# EAGLE design Hypnos_V0 (EAGLE 9.6.1)
APPROVED: -; CHECKED: MAR; DRAWN: MAR; REVISION: -

## Sheet 1 of 3
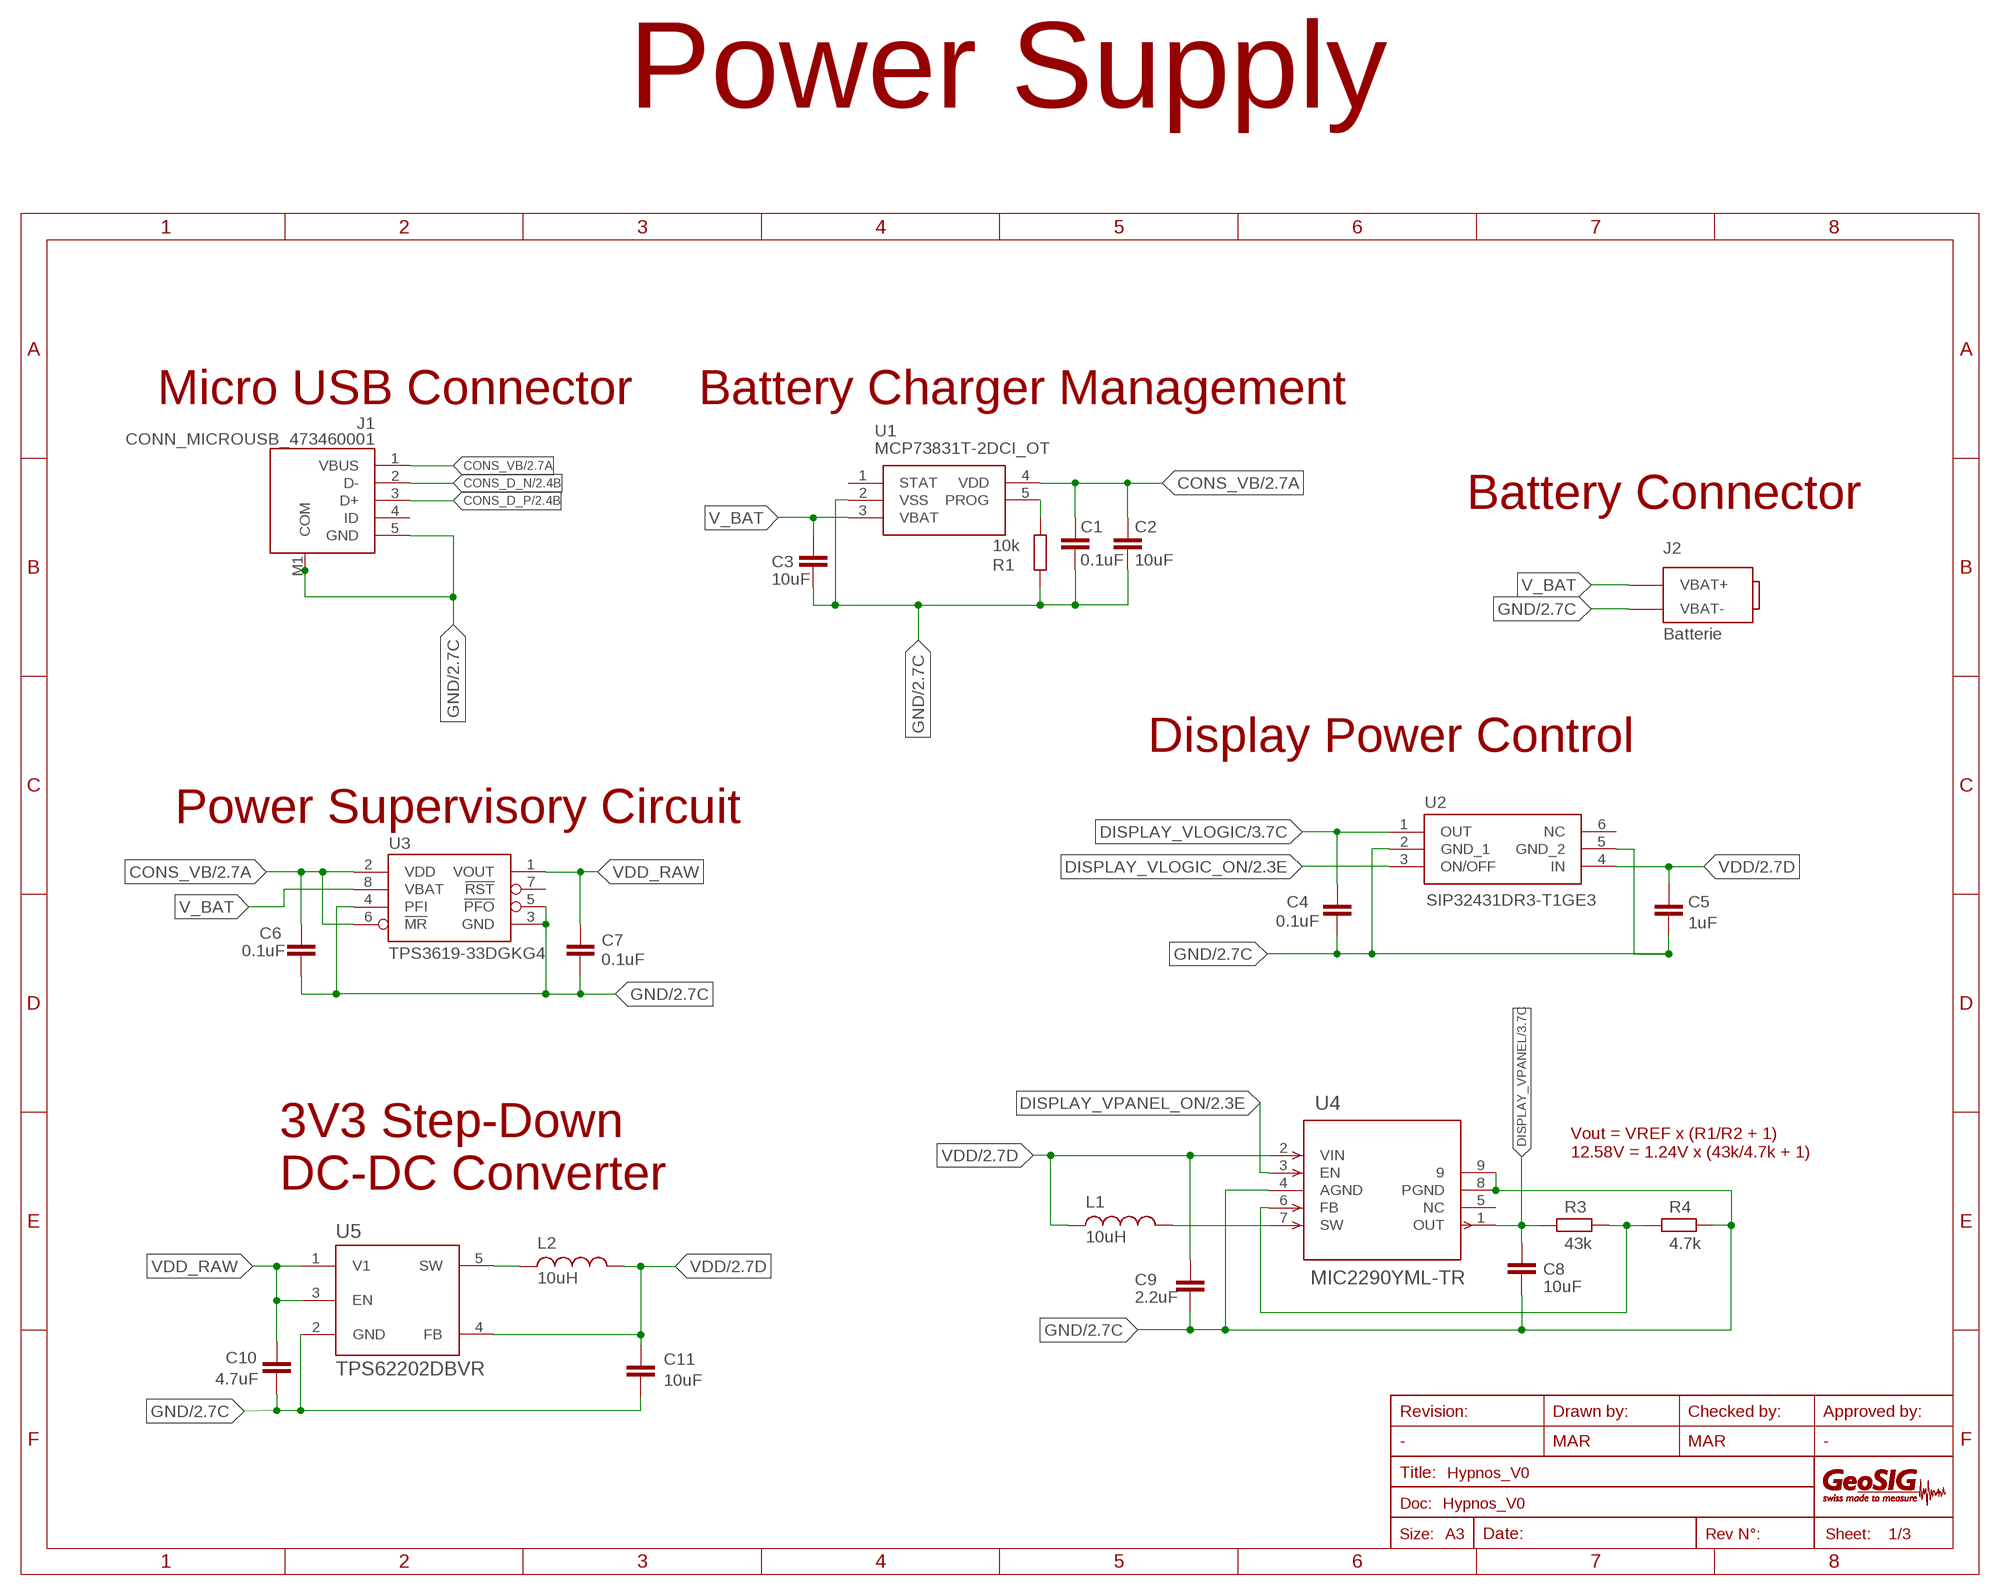
[diagram p0: schematic, sheet 1]
FRAME1 (FRAME_A4_REVIEWED): ASSEMBLY: A0; CHECKED: MAR; DRAWN: MAR; EAN: NONE; GSN: NONE; IN_BOM: NO; MPN: NONE; ORGANISATION: GeoSIG Ltd. Switzerland; TITLE: Hypnos_V0

### Parts
C1  0.1uF  C0603  [C0603K]
C2  10uF  C0603  [C0603K]
C3  10uF  C0603  [C0603K]
C4  0.1uF  C0603  [C0603K]
C5  1uF  C0603  [C0603K]
C6  0.1uF  C0603  [C0603K]
C7  0.1uF  C0603  [C0603K]
C8  10uF  C0603  [C0603K]
C9  2.2uF  C0603  [C0603K]
C10  4.7uF  C0603  [C0603K]
C11  10uF  C0603  [C0603K]
J1  CONN_MICROUSB_473460001  [CONN_MOLEX_473460001]
J2  Batterie  BATTERIE  [BATTERIE]
L1  10uH  INDUCT1210  [L1210]
L2  10uH  INDUCT1210  [L1210]
R1  10k  R-EU_R0603  [R0603]
R3  43k  R-EU_R0603  [R0603]
R4  4.7k  R-EU_R0603  [R0603]
U1  MCP73831T-2DCI_OT  [SOT95P270X145-5N]
U2  SIP32431DR3-T1GE3  [SOT65P210X110-6N]
U3  TPS3619-33DGKG4  [MSOP8]
U4  MIC2290YML-TR  [MLF-8_ML_MCH]
U5  TPS62202DBVR  [SOT95P280X145-5N]

### Nets
CONS_D_N: J1.2(D-) ; also sheet 2
CONS_D_P: J1.3(D+) ; also sheet 2
CONS_VB: C1.1 C2.1 C6.1 J1.1(VBUS) U1.4(VDD) U3.2(VDD) U3.6(!MR) ; also sheet 2
DISPLAY_VLOGIC: C4.1 U2.1(OUT) ; also sheet 3
DISPLAY_VLOGIC_ON: U2.3(ON/OFF) ; also sheet 2
DISPLAY_VPANEL: C8.1 R3.2 U4.1(OUT) ; also sheet 3
DISPLAY_VPANEL_ON: U4.3(EN) ; also sheet 2
FB: R3.1 R4.2 U4.6(FB)
GND: C1.2 C2.2 C3.2 C4.2 C5.2 C6.2 C7.2 C8.2 C9.2 C10.2 C11.2 J1.5(GND) J1.M1(COM) J1.M2(COM) J1.M3(COM) J1.M4(COM) J1.M5(COM) J1.M6(COM) J2.2(VBAT-) R1.2 R4.1 U1.2(VSS) U2.2(GND_1) U2.5(GND_2) U3.3(GND) U3.4(PFI) U3.5(!PFO) U4.4(AGND) U4.8(PGND) U4.9 U5.2(GND) ; also sheet 2,3
N$4: L2.1 U5.5(SW)
PROG: R1.1 U1.5(PROG)
SW: L1.2 U4.7(SW)
V_BAT: C3.1 J2.1(VBAT+) U1.3(VBAT) U3.8(VBAT)
VDD: C5.1 C9.1 C11.1 L1.1 L2.2 U2.4(IN) U4.2(VIN) U5.4(FB) ; also sheet 2,3
VDD_RAW: C7.1 C10.1 U3.1(VOUT) U5.1(V1) U5.3(EN)
Unconnected: J1.4(ID) U1.1(STAT) U2.6(NC) U3.7(!RST) U4.5(NC)

### Notes on the sheet
- Power Supply
- Micro USB Connector | Battery Charger Management
- Battery Connector
- Display Power Control
- Power Supervisory Circuit
- Vout = VREF x (R1/R2 + 1)
  12.58V = 1.24V x (43k/4.7k + 1)
- 3V3 Step-Down
  DC-DC Converter

## Sheet 2 of 3
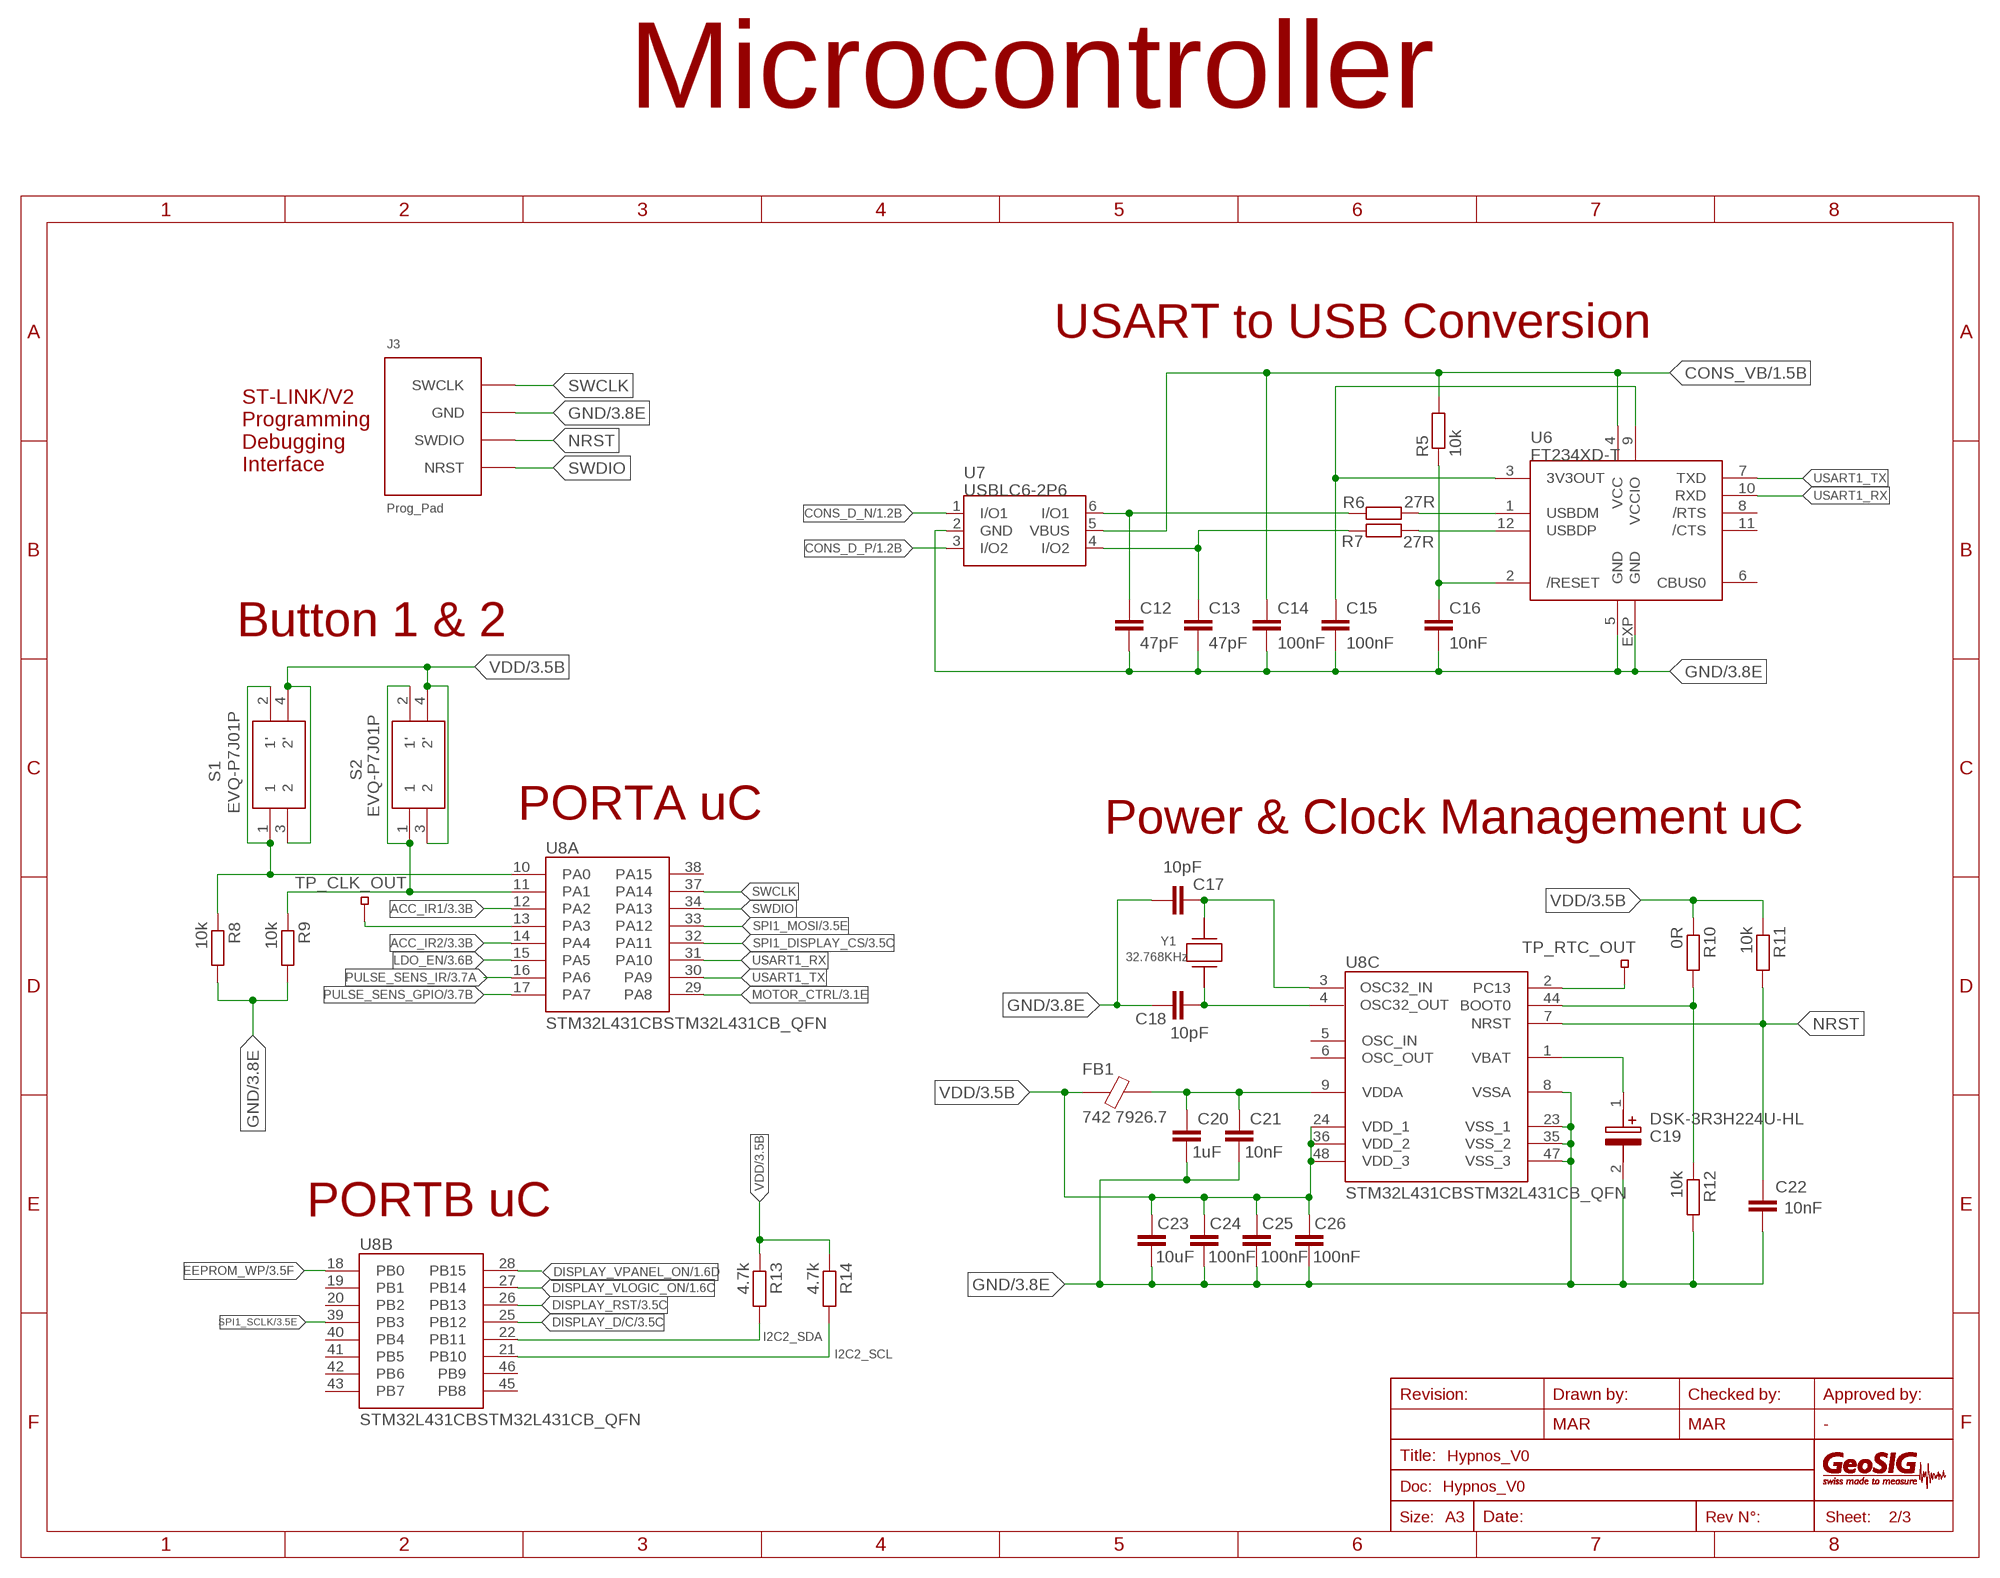
[diagram p1: schematic, sheet 2]
FRAME2 (FRAME_A4_REVIEWED): ASSEMBLY: A0; EAN: NONE; GSN: NONE; IN_BOM: NO; MPN: NONE; ORGANISATION: GeoSIG Ltd. Switzerland; TITLE: Hypnos_V0

### Parts
C12  47pF  C0603  [C0603K]
C13  47pF  C0603  [C0603K]
C14  100nF  C0603  [C0603K]
C15  100nF  C0603  [C0603K]
C16  10nF  C0603  [C0603K]
C17  10pF  C0603  [C0603K]
C18  10pF  C0603  [C0603K]
C19  DSK-3R3H224U-HL  [DSK3R3H334THL]
C20  1uF  C0603  [C0603K]
C21  10nF  C0603  [C0603K]
C22  10nF  C0603  [C0603K]
C23  10uF  C0603  [C0603K]
C24  100nF  C0603  [C0603K]
C25  100nF  C0603  [C0603K]
C26  100nF  C0603  [C0603K]
FB1  742 7926.7  FERRITE_BEAD0603  [FB0603]
J3  Prog_Pad  PROG_PAD  [PROG_PAD]
R5  10k  R-EU_R0603  [R0603]
R6  27R  R-EU_R0603  [R0603]
R7  27R  R-EU_R0603  [R0603]
R8  10k  R-EU_R0603  [R0603]
R9  10k  R-EU_R0603  [R0603]
R10  0R  R-EU_R0603  [R0603]
R11  10k  R-EU_R0603  [R0603]
R12  10k  R-EU_R0603  [R0603]
R13  4.7k  R-EU_R0603  [R0603]
R14  4.7k  R-EU_R0603  [R0603]
S1  EVQ-P7J01P  [EVQP7J01P]
S2  EVQ-P7J01P  [EVQP7J01P]
TP_CLK_OUT  TEST_PIN_SMD  [SMD_1]
TP_RTC_OUT  TEST_PIN_SMD  [SMD_1]
U6  FT234XD-T  [DFN12-3X3]
U7  USBLC6-2P6  [SOT666]
U8  STM32L431CBSTM32L431CB_QFN  [QFN50P700X700X60-49N]
Y1  32.768KHz  QUARTZ1-CM315-32.768KDZY-UT  [CM315]

### Nets
/RESET: C16.1 R5.1 U6.2(/RESET)
ACC_IR1: U8.12(A:PA2) ; also sheet 3
ACC_IR2: U8.14(A:PA4) ; also sheet 3
BUTTON1: R8.1 S1.1 S1.2(1') U8.10(A:PA0)
BUTTON2: R9.1 S2.1 S2.2(1') U8.11(A:PA1)
CLK_OUT: TP_CLK_OUT.P$1 U8.13(A:PA3)
CONS_D_N: U7.1(I/O1) ; also sheet 1
CONS_D_P: U7.3(I/O2) ; also sheet 1
CONS_VB: C14.1 R5.2 U6.4(VCC) U7.5(VBUS) ; also sheet 1
DISPLAY_D/C: U8.25(B:PB12) ; also sheet 3
DISPLAY_RST: U8.26(B:PB13) ; also sheet 3
DISPLAY_VLOGIC_ON: U8.27(B:PB14) ; also sheet 1
DISPLAY_VPANEL_ON: U8.28(B:PB15) ; also sheet 1
EEPROM_WP: U8.18(B:PB0) ; also sheet 3
GND: C12.2 C13.2 C14.2 C15.2 C16.2 C17.2 C18.2 C19.2(-) C20.2 C21.2 C22.2 C23.2 C24.2 C25.2 C26.2 J3.2(GND) R8.2 R9.2 R12.2 U6.5(GND) U6.EXP(GND) U7.2(GND) U8.8(C:VSSA) U8.23(C:VSS_1) U8.35(C:VSS_2) U8.47(C:VSS_3) ; also sheet 1,3
I2C2_SCL: R14.2 U8.21(B:PB10) ; also sheet 3
I2C2_SDA: R13.2 U8.22(B:PB11) ; also sheet 3
LDO_EN: U8.15(A:PA5) ; also sheet 3
MOTOR_CTRL: U8.29(A:PA8) ; also sheet 3
N$1: C18.1 U8.4(C:OSC32_OUT) Y1.P$2
N$2: C17.1 U8.3(C:OSC32_IN) Y1.P$1
N$3: C19.1(+) U8.1(C:VBAT)
N$9: R10.2 R12.1 U8.44(C:BOOT0)
N$41: C13.1 R7.2 U7.4(I/O2)
N$42: C12.1 R6.2 U7.6(I/O1)
NRST: C22.1 J3.3(SWDIO) R11.2 U8.7(C:NRST)
PULSE_SENS_GPIO: U8.17(A:PA7) ; also sheet 3
PULSE_SENS_IR: U8.16(A:PA6) ; also sheet 3
RTC_OUT: TP_RTC_OUT.P$1 U8.2(C:PC13)
SPI1_DISPLAY_CS: U8.32(A:PA11) ; also sheet 3
SPI1_MOSI: U8.33(A:PA12) ; also sheet 3
SPI1_SCLK: U8.39(B:PB3) ; also sheet 3
SWCLK: J3.1(SWCLK) U8.37(A:PA14)
SWDIO: J3.4(NRST) U8.34(A:PA13)
USART1_RX: U6.10(RXD) U8.31(A:PA10)
USART1_TX: U6.7(TXD) U8.30(A:PA9)
USBDM: R6.1 U6.1(USBDM)
USBDP: R7.1 U6.12(USBDP)
VCCIO: C15.1 U6.3(3V3OUT) U6.9(VCCIO)
VDD: C23.1 C24.1 C25.1 C26.1 FB1.1 R10.1 R11.1 R13.1 R14.1 S1.3 S1.4(2') S2.3 S2.4(2') U8.24(C:VDD_1) U8.36(C:VDD_2) U8.48(C:VDD_3) ; also sheet 1,3
VDDA: C20.1 C21.1 FB1.2 U8.9(C:VDDA)
Unconnected: U6.6(CBUS0) U6.8(/RTS) U6.11(/CTS) U8.5(C:OSC_IN) U8.6(C:OSC_OUT) U8.19(B:PB1) U8.20(B:PB2) U8.38(A:PA15) U8.40(B:PB4) U8.41(B:PB5) U8.42(B:PB6) U8.43(B:PB7) U8.45(B:PB8) U8.46(B:PB9)

### Notes on the sheet
- Microcontroller
- USART to USB Conversion
- ST-LINK/V2 
  Programming 
  Debugging 
  Interface
- Button 1 & 2
- PORTA uC | Power & Clock Management uC
- PORTB uC

## Sheet 3 of 3
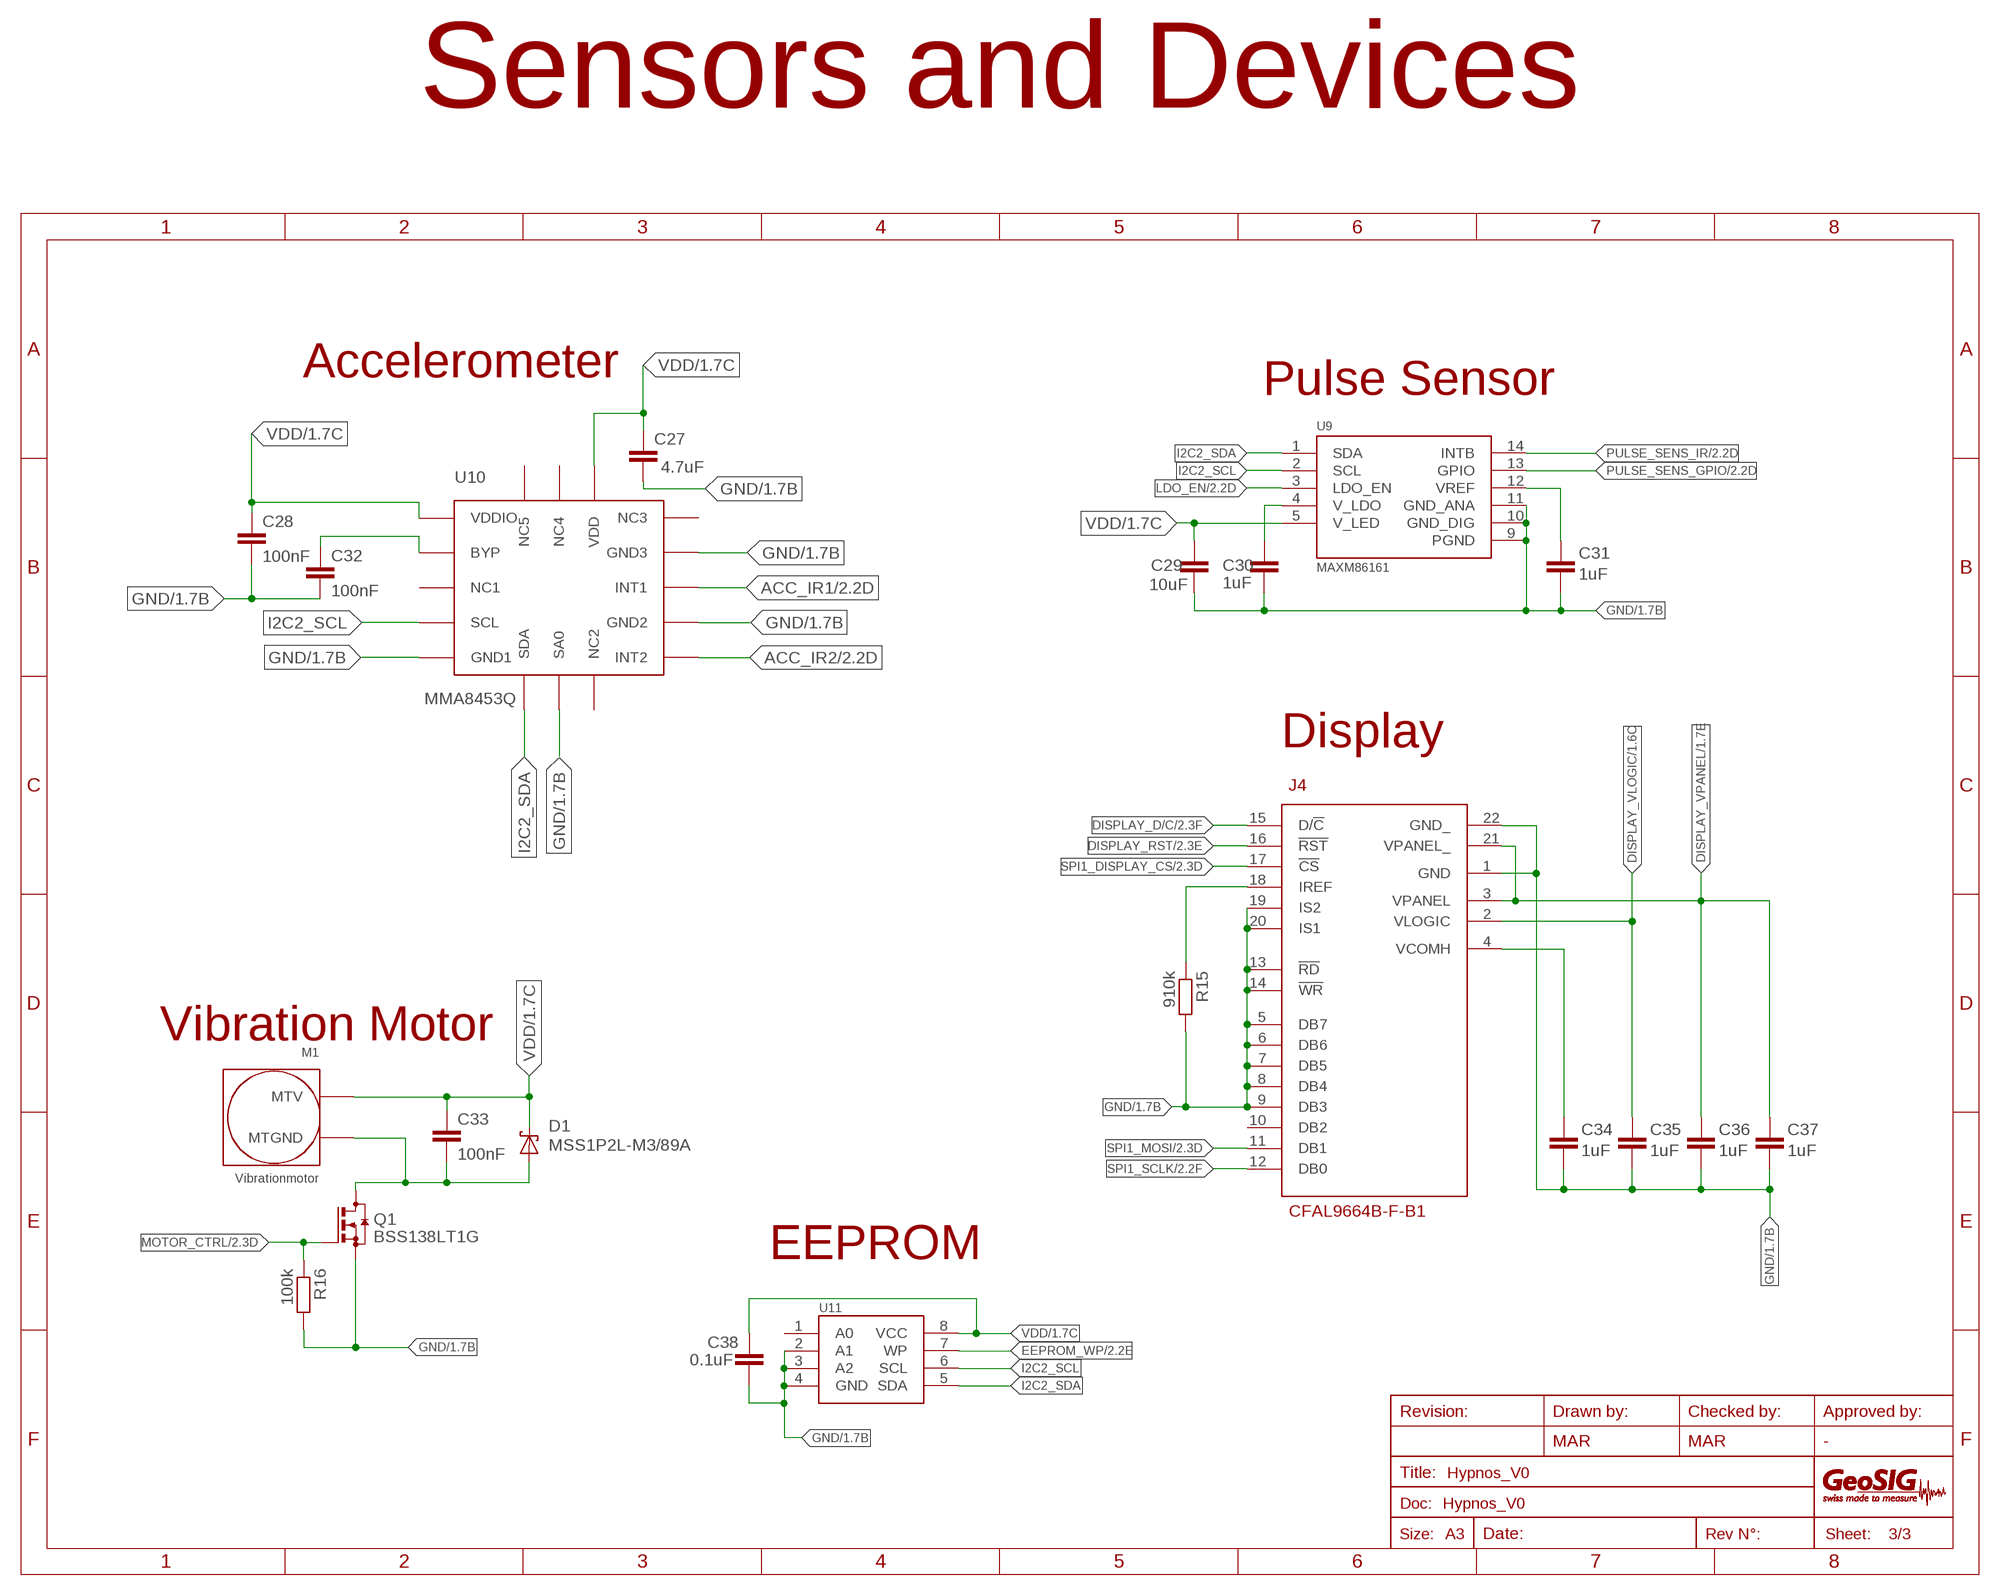
[diagram p2: schematic, sheet 3]
FRAME3 (FRAME_A4_REVIEWED): ASSEMBLY: A0; EAN: NONE; GSN: NONE; IN_BOM: NO; MPN: NONE; ORGANISATION: GeoSIG Ltd. Switzerland; TITLE: Hypnos_V0

### Parts
C27  4.7uF  C0603  [C0603K]
C28  100nF  C0603  [C0603K]
C29  10uF  C0603  [C0603K]
C30  1uF  C0603  [C0603K]
C31  1uF  C0603  [C0603K]
C32  100nF  C0603  [C0603K]
C33  100nF  C0603  [C0603K]
C34  1uF  C0603  [C0603K]
C35  1uF  C0603  [C0603K]
C36  1uF  C0603  [C0603K]
C37  1uF  C0603  [C0603K]
C38  0.1uF  C0603  [C0603K]
D1  MSS1P2L-M3/89A  [MICROSMP]
J4  CFAL9664B-F-B1  [CFAL9664B-F-B1]
M1  Vibrationmotor  VIBRATIONMOTOR  [VIBRATIONMOTOR]
Q1  BSS138LT1G  [SOT23]
R15  910k  R-EU_R0603  [R0603]
R16  100k  R-EU_R0603  [R0603]
U9  MAXM86161  [MAXM86161]
U10  MMA8453Q  [QFN-COL]
U11  BR24T1MFJ-3AME2  [SOIC127P600X165-8N]

### Nets
ACC_IR1: U10.P$11(INT1) ; also sheet 2
ACC_IR2: U10.P$9(INT2) ; also sheet 2
BYP: C32.1 U10.P$2(BYP)
DISPLAY_D/C: J4.15(D/!C) ; also sheet 2
DISPLAY_RST: J4.16(!RST) ; also sheet 2
DISPLAY_VLOGIC: C35.1 J4.2(VLOGIC) ; also sheet 1
DISPLAY_VPANEL: C36.1 C37.1 J4.3(VPANEL) J4.21(VPANEL_) ; also sheet 1
EEPROM_WP: U11.7(WP) ; also sheet 2
GND: C27.2 C28.2 C29.2 C30.2 C31.2 C32.2 C34.2 C35.2 C36.2 C37.2 C38.2 J4.1(GND) J4.5(DB7) J4.6(DB6) J4.7(DB5) J4.8(DB4) J4.9(DB3) J4.13(!RD!) J4.14(!WR!) J4.19(IS2) J4.20(IS1) J4.22(GND_) Q1.2(S) R15.2 R16.2 U9.9(PGND) U9.10(GND_DIG) U9.11(GND_ANA) U10.P$5(GND1) U10.P$7(SA0) U10.P$10(GND2) U10.P$12(GND3) U11.2(A1) U11.3(A2) U11.4(GND) ; also sheet 1,2
I2C2_SCL: U9.2(SCL) U10.P$4(SCL) U11.6(SCL) ; also sheet 2
I2C2_SDA: U9.1(SDA) U10.P$6(SDA) U11.5(SDA) ; also sheet 2
IREF: J4.18(IREF) R15.1
LDO_EN: U9.3(LDO_EN) ; also sheet 2
MOTOR_CTRL: Q1.1(G) R16.1 ; also sheet 2
MTGND: C33.2 D1.A M1.1(MTGND) Q1.3(D)
PULSE_SENS_GPIO: U9.13(GPIO) ; also sheet 2
PULSE_SENS_IR: U9.14(INTB) ; also sheet 2
SPI1_DISPLAY_CS: J4.17(!CS) ; also sheet 2
SPI1_MOSI: J4.11(DB1) ; also sheet 2
SPI1_SCLK: J4.12(DB0) ; also sheet 2
V_LDO: C30.1 U9.4(V_LDO)
V_REF: C31.1 U9.12(VREF)
VCOMH: C34.1 J4.4(VCOMH)
VDD: C27.1 C28.1 C29.1 C33.1 C38.1 D1.C M1.2(MTV) U9.5(V_LED) U10.P$1(VDDIO) U10.P$14(VDD) U11.8(VCC) ; also sheet 1,2
Unconnected: J4.10(DB2) U10.P$3(NC1) U10.P$8(NC2) U10.P$13(NC3) U10.P$15(NC4) U10.P$16(NC5) U11.1(A0)

### Notes on the sheet
- Sensors and Devices
- Accelerometer
- Pulse Sensor
- Display
- Vibration Motor
- EEPROM

## Library data of the parts
C1-C18 C20-C38 = GS_Capacitor:C: CAPACITOR naming: grid - package width; ASSEMBLY: A0; EAN: NONE; GSN: NONE; IN_BOM: YES; MPN: NONE
C19 = SamacSys_Parts:DSK-3R3H224U-HL: Supercapacitors / Ultracapacitors 3.3V .22F 6.8x2.1 Source: Datasheet <https://componentsearchengine.com/Datasheets/1/DSK-3R3H224U-HL.pdf>; DESCRIPTION: Supercapacitors / Ultracapacitors 3.3V .22F 6.8x2.1; HEIGHT: 3mm; MANUFACTURER_NAME: Elna; MANUFACTURER_PART_NUMBER: DSK-3R3H224U-HL; MOUSER_PART_NUMBER: 555-DSK3R3H224U-HL; MOUSER_PRICE-STOCK: https://www.mouser.co.uk/ProductDetail/Elna/DSK-3R3H224U-HL?qs=QQsyD2Kvh2ftLwsh6FwcaA%3D%3D
D1 = GS_Diode:MSS1P2L: Diode Schottky, 20V, 1A, Diodes & Rectifiers, MSS1P2L-M3/89A, Vishay; A: A; ASSEMBLY: A0; C: C; EAN: 2900000154810; GSN: #D_SKY.200.001; IN_BOM: YES; MPN: MSS1P2L-M3/89A
FB1 = GS_Other:FERRITE_BEAD; ASSEMBLY: A0; EAN: NONE; GSN: NONE; IN_BOM: YES; MPN: NONE
J1 = GS_Connector:CONN_MICROUSB_473460001: Molex MicroUSB type B socket.; ASSEMBLY: A0; EAN: NONE; GSN: NONE; IN_BOM: YES; MPN: 47346-0001
J2 = Batterie:BATTERIE
J3 = Prog_Pad:PROG_PAD
J4 = CFAL9664B-F-B1:CFAL9664B-F-B1
L1 L2 = GS_Inductor:INDUCT; ASSEMBLY: A0; EAN: NONE; GSN: NONE; IN_BOM: YES; MPN: NONE
M1 = Vibrationmotor:VIBRATIONMOTOR
Q1 = GS_Transistor:BSS138: Transistor Small signal FET, 220mA, 50V, 3 PINS, SOT-23, BSS138, MOSFET, N-Channel, SOT-23, 50V, 200mA, 3.5R; ASSEMBLY: A0; EAN: 2900000154612; GSN: #T_SSF.000.006; IN_BOM: YES; MPN: BSS138LT1G
R1 R3-R16 = GS_Resistor:R-EU_: RESISTOR, European symbol; ASSEMBLY: A0; EAN: NONE; GSN: NONE; IN_BOM: YES; MPN: NONE
S1 S2 = SamacSys_Parts:EVQ-P7J01P: Switch,Tactile,3.5x2.9mm,Light Touch Black Side Tactile Switch, SPST 50 mA@ 12 V dc 1.7mm Source: Datasheet <https://www3.panasonic.biz/ac/e_download/control/switch/light-touch/catalog/sw_lt_eng_3529s_side.pdf>; DESCRIPTION: Switch,Tactile,3.5x2.9mm,Light Touch Black Side Tactile Switch, SPST 50 mA@ 12 V dc 1.7mm; HEIGHT: 1mm; MANUFACTURER_NAME: Panasonic; MANUFACTURER_PART_NUMBER: EVQ-P7J01P; MOUSER_PART_NUMBER: 667-EVQP7J01P; MOUSER_PRICE-STOCK: https://www.mouser.co.uk/ProductDetail/Panasonic/EVQ-P7J01P?qs=rJ%252BziJWpyszkfuBTA00z9w%3D%3D
TP_CLK_OUT TP_RTC_OUT = GS_Jumper:TEST_PIN_SMD; ASSEMBLY: A0; EAN: NONE; GSN: NONE; IN_BOM: NO; MPN: NONE
U1 = SamacSys_Parts:MCP73831T-2DCI_OT: Charge Controller Li-Ion/Li-Pol Source: Datasheet <http://ww1.microchip.com/downloads/en/DeviceDoc/20001984g.pdf>; DESCRIPTION: Charge Controller Li-Ion/Li-Pol; HEIGHT: 1.45mm; MANUFACTURER_NAME: Microchip; MANUFACTURER_PART_NUMBER: MCP73831T-2DCI/OT; MOUSER_PART_NUMBER: 579-MCP73831T-2DCIOT; MOUSER_PRICE-STOCK: https://www.mouser.co.uk/ProductDetail/Microchip-Technology/MCP73831T-2DCI-OT?qs=yUQqVecv4qu38ml9qkvsJw%3D%3D
U2 = SamacSys_Parts:SIP32431DR3-T1GE3: VISHAY - SIP32431DR3-T1GE3 - IC, LOAD SWITCH, 1.1V-5.5V, 1A, SC70 Source: Datasheet <https://www.vishay.com/docs/66597/sip32431.pdf>; DESCRIPTION: VISHAY - SIP32431DR3-T1GE3 - IC, LOAD SWITCH, 1.1V-5.5V, 1A, SC70; HEIGHT: 1.1mm; MANUFACTURER_NAME: Vishay; MANUFACTURER_PART_NUMBER: SIP32431DR3-T1GE3; MOUSER_PART_NUMBER: 781-SIP32431DR3-GE3; MOUSER_PRICE-STOCK: https://www.mouser.co.uk/ProductDetail/Vishay-Semiconductors/SIP32431DR3-T1GE3?qs=FfLXECYddQQfTuH6ZEcWCg%3D%3D
U3 = GS_IC:TPS3619-33: IC Power, MSOP8, TEXAS INSTRUMENTS, TPS3619-33DGKG4, SM SUPERVISORY CIRCUIT; ASSEMBLY: A0; EAN: 2900000080300; GSN: #U_PWR.000.009; IN_BOM: YES; MPN: TPS3619-33DGKG4
U4 = MIC2290YML-TR:MIC2290YML-TR; BUILT_BY: EMA_Jessica; COPYRIGHT: Copyright (C) 2018 Accelerated Designs. All rights reserved; MANUFACTURER_PART_NUMBER: MIC2290YML-TR; SOURCELIBRARY: Microchip_2019-08-23_2; VENDOR: Microchip
U5 = TPS62202DBVR:TPS62202DBVR: HIGH-EFFICIENCY, SOT23 STEP-DOWN, DC-DC CONVERTER; AVAILABILITY: Unavailable; DESCRIPTION: 1.8-V Output, 300-mA, 95% Efficient Step-Down Converter in SOT-23 5-SOT-23 -40 to 85; MF: Texas Instruments; MP: TPS62202DBVR; PACKAGE: SOT-23-5 Texas Instruments; PRICE: None
U6 = GS_IC:FT234XD: IC Line driver, SMD, DFN-12, USB to Basic Serial UART IC, FT234XD-T, FTDI; ASSEMBLY: A0; EAN: 2900000168039; GSN: #U_LDR.000.056.S; IN_BOM: YES; MPN: FT234XD-T
U7 = GS_Diode:USBLC6-2: Capacitor, 2.5pf, 5A, 6V, SMD, SOT666, Unidirectional, ESD Suppressors High Speed Interface Protection Low Cap, USBLC6-2P6, STMicroelectronics; ASSEMBLY: A0; EAN: 2900000168008; GSN: #C_112.002.006.S; IN_BOM: YES; MPN: USBLC6-2P6
U8 = STM32L431CB:STM32L431CB
U9 = MAXM86161:MAXM86161: Oximeter/Heart Rate Sensor; AVAILABILITY: Warning; DESCRIPTION: Oximeter/Heart Rate Sensor I²C Output; DIGIKEY-PURCHASE-URL: https://snapeda.com/shop?store=DigiKey&id=554104; MF: Maxim Integrated; MOUSER-PURCHASE-URL: https://snapeda.com/shop?store=Mouser&id=554104; MP: MAX30101EFD+; PACKAGE: OLGA-14 Maxim; PRICE: None
U10 = MMA8453Q:MMA8453Q; AVAILABILITY: Unavailable; DESCRIPTION: Accelerometer X, Y, Z Axis ±2g, 4g, 8g 0.78Hz ~ 400Hz 16-QFN _3x3_; MF: NXP Semiconductors; MP: MMA8453Q; PACKAGE: QFN-16 NXP Semiconductors; PRICE: None
U11 = BR24T1MFJ-3AME2:BR24T1MFJ-3AME2
Y1 = GS_Other:QUARTZ1: Quartz, SMD, 4 PINS, X; ASSEMBLY: A0; EAN: 2900000083868; GSN: #X_032.768.003.XX; IN_BOM: YES; MPN: CM315-32.768KDZY-UT

## Board
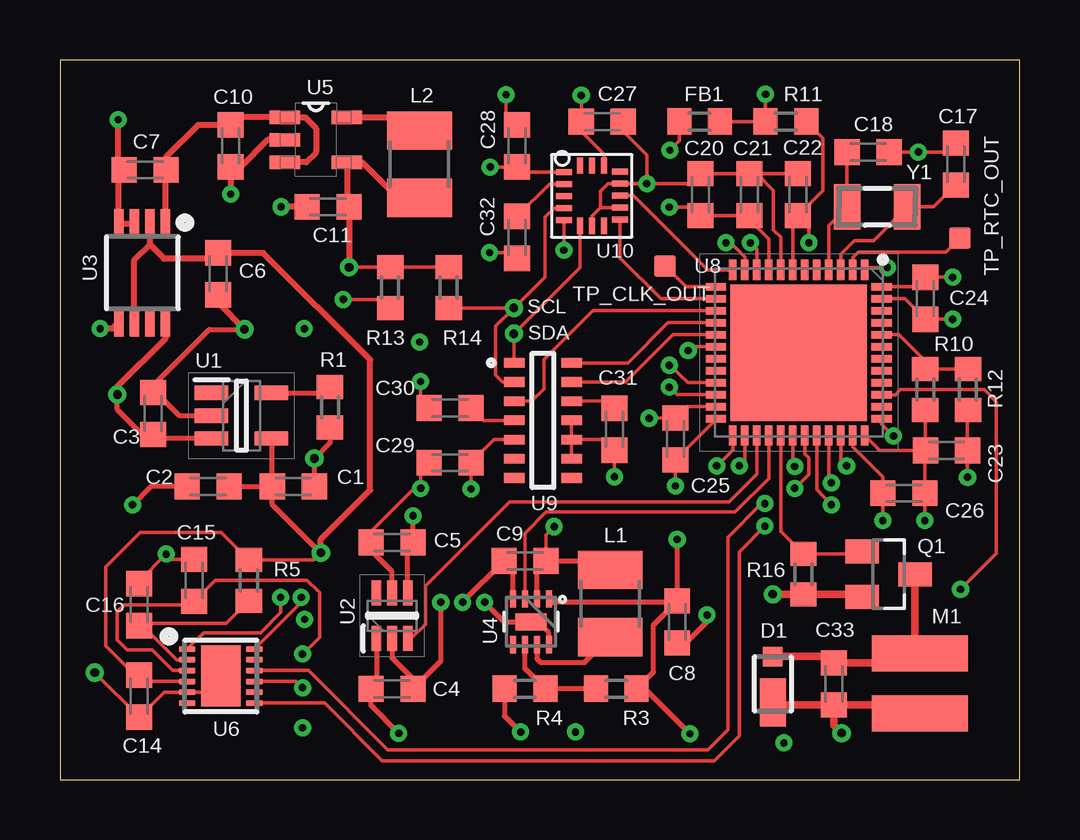
[diagram p3: board, top side]
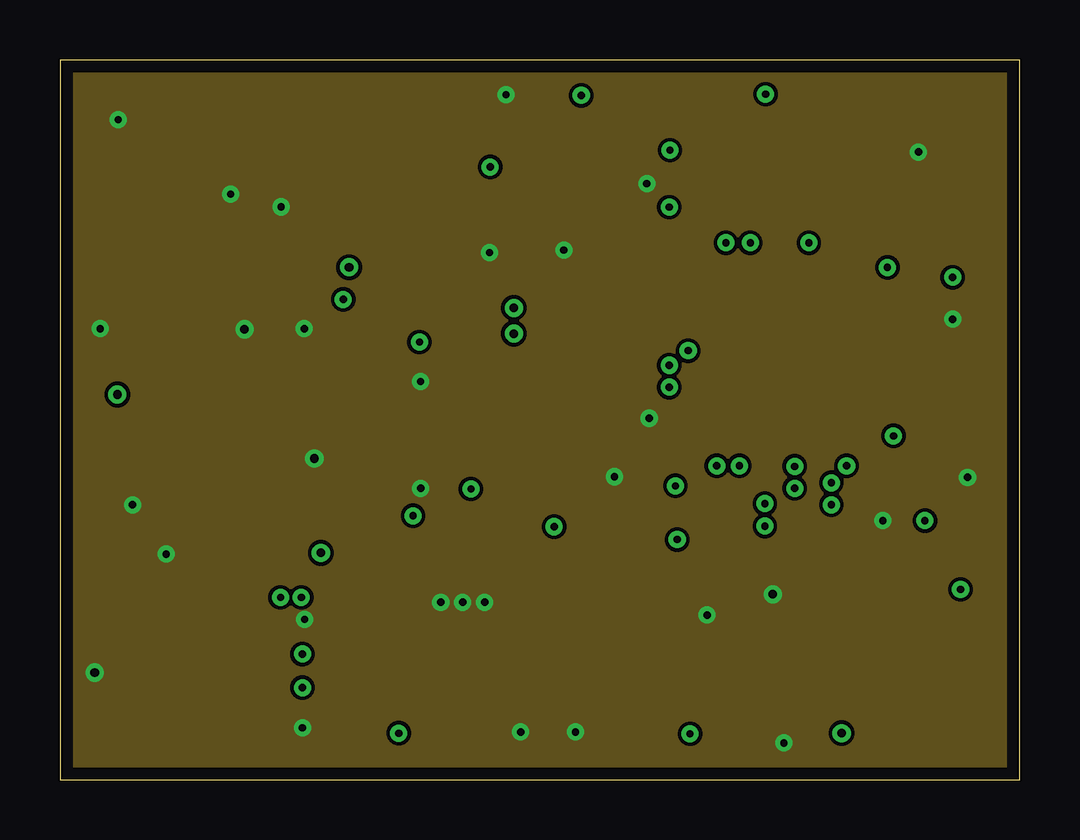
[diagram p4: board, inner layer Route2]
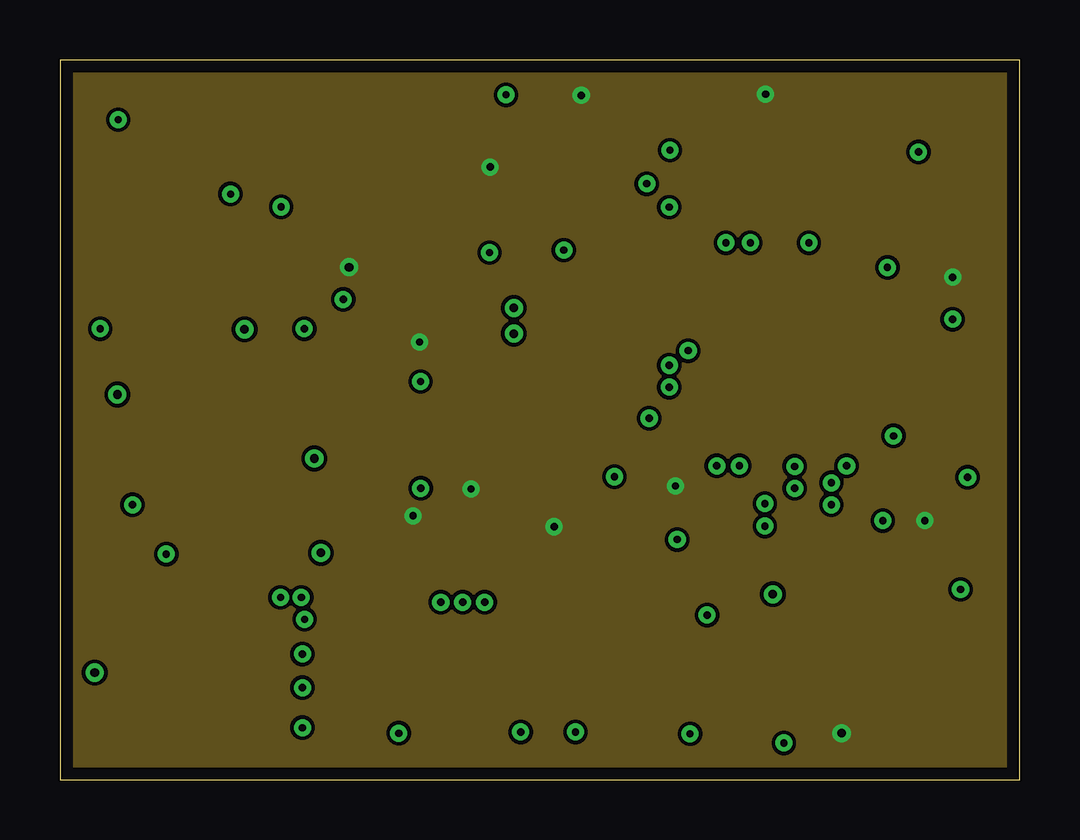
[diagram p5: board, inner layer Route15]
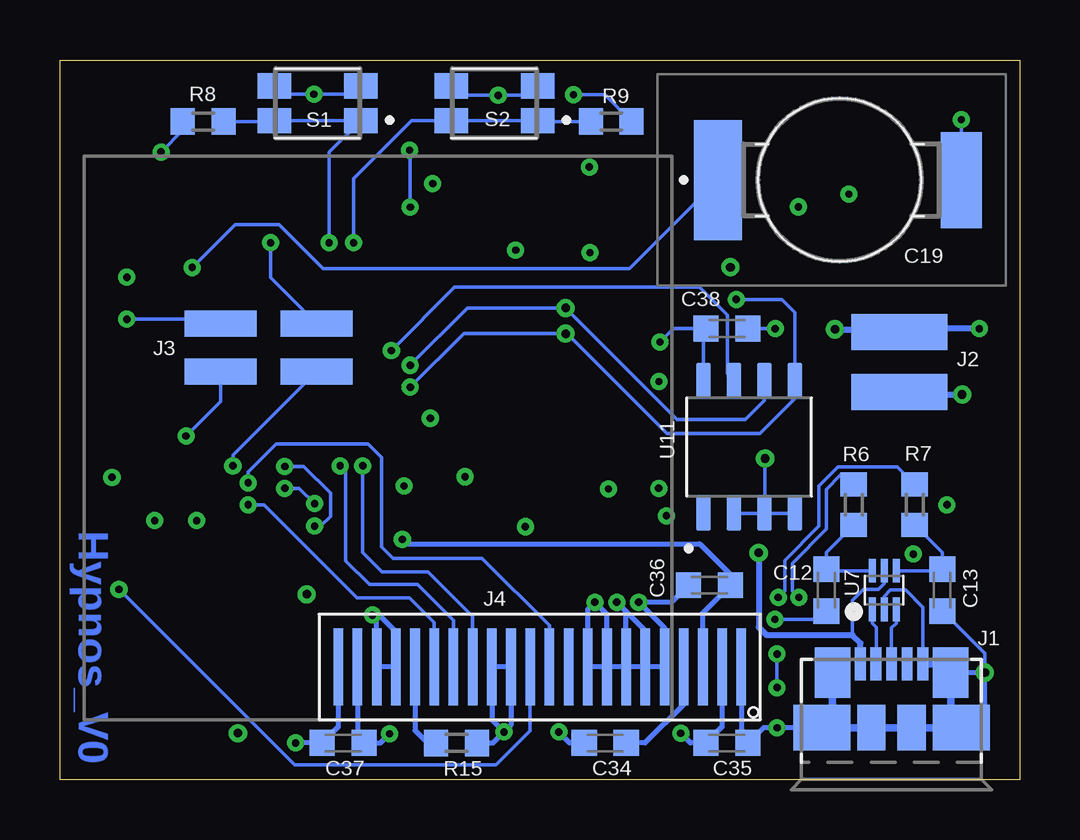
[diagram p6: board, bottom side, seen from below]

Size 40 x 30 mm. Coordinates in mm from the lower left corner, seen from the top.
Outline: 0,0 40,0 40,30 0,30 0,0
Copper layers (1*2*15*16): Top 0.035mm / dielectric 0.25mm / Route2 0.035mm / dielectric 0.96mm / Route15 0.035mm / dielectric 0.25mm / Bottom 0.035mm
Design rules "GS_4_layers": minimum track width 6mil, minimum drill 8mil, track to track 6mil, track to pad 6mil, pad to pad 6mil, via to via 6mil, smd to smd 6mil, copper to edge 20mil, drill to drill 8mil, minimum pad ring 10mil, minimum via ring 8mil, stop-mask expansion 2mil, vias tented up to drill 25mil, thermal gap 10mil

### Footprints (pad centres in the part's own frame; a part is rotated, then mirrored left to right if it is on the bottom)
C0603K = smd 1.05 x 1.08: 1 -0.875,0; 2 0.875,0
DSK3R3H334THL = smd 5 x 2: 1 0,5.075 | smd 4 x 1.7: 2 0,-5.075
MICROSMP = smd 0.813 x 0.813: A 1.143,0 | smd 2.007 x 1.092: C -0.762,0
FB0603 = smd 1 x 1.1: 1 -0.85,0; 2 0.85,0
CONN_MOLEX_473460001 = smd 0.45 x 1.38: 1 -1.3,2.66; 2 -0.65,2.66; 3 0,2.66; 4 0.65,2.66; 5 1.3,2.66 | smd 1.475 x 2.1: M1 2.462,2.3; M2 -2.462,2.3 | smd 1.175 x 1.9: M3 -0.838,0; M4 0.838,0 | smd 2.375 x 1.9: M5 -2.913,0; M6 2.913,0
BATTERIE = smd 4 x 1.5: 1 -0.04,-1.27; 2 -0.04,1.23
PROG_PAD = smd 3 x 1.1: 1 2,2; 2 2,4; 3 6,4; 4 6,2
CFAL9664B-F-B1 = smd 3.2 x 0.4: 1 0,-8.4; 2 0,-7.6; 3 0,-6.8; 4 0,-6; 5 0,-5.2; 6 0,-4.4; 7 0,-3.6; 8 0,-2.8; 9 0,-2; 10 0,-1.2; 11 0,-0.4; 12 0,0.4; 13 0,1.2; 14 0,2; 15 0,2.8; 16 0,3.6; 17 0,4.4; 18 0,5.2; 19 0,6; 20 0,6.8; 21 0,7.6; 22 0,8.4
L1210 = smd 1.6 x 2.7: 1 -1.4,0; 2 1.4,0
VIBRATIONMOTOR = smd 4 x 1.5: 1 -0.04,-1.27; 2 -0.04,1.23
SOT23 = smd 1 x 1.4: 1 -0.95,-1.1; 2 0.95,-1.1; 3 0,1.1
R0603 = smd 1 x 1.1: 1 -0.85,0; 2 0.85,0
EVQP7J01P = smd 1.4 x 1.05: 1 -1.5,0.725; 2 2.1,0.725; 3 -1.5,-0.725; 4 2.1,-0.725
SMD_1 = smd 0.889 x 0.889: P$1 0,0
SOT95P270X145-5N = smd 1.4 x 0.6: 1 -1.25,0.95; 2 -1.25,0; 3 -1.25,-0.95; 4 1.25,-0.95; 5 1.25,0.95
SOT65P210X110-6N = smd 1.05 x 0.4: 1 -0.95,0.65; 2 -0.95,0; 3 -0.95,-0.65; 4 0.95,-0.65; 5 0.95,0; 6 0.95,0.65
MSOP8 = smd 0.4 x 1.2: 1 -0.975,-2.05; 2 -0.325,-2.05; 3 0.325,-2.05; 4 0.975,-2.05; 5 0.975,2.05; 6 0.325,2.05; 7 -0.325,2.05; 8 -0.975,2.05
MLF-8_ML_MCH = smd 0.711 x 0.254: 1 -0.953,0.75; 2 -0.953,0.25; 3 -0.953,-0.25; 4 -0.953,-0.75; 5 0.953,-0.75; 6 0.953,-0.25; 7 0.953,0.25; 8 0.953,0.75 | smd 0.711 x 1.295: 9 0,0
SOT95P280X145-5N = smd 1.27 x 0.559: 1 -1.295,0.94; 2 -1.295,0; 3 -1.295,-0.94; 4 1.295,-0.94; 5 1.295,0.94
DFN12-3X3 = smd 0.25 x 0.7: 1 -1.125,-1.4; 2 -0.675,-1.4; 3 -0.225,-1.4; 4 0.225,-1.4; 5 0.675,-1.4; 6 1.125,-1.4; 7 1.125,1.4; 8 0.675,1.4; 9 0.225,1.4; 10 -0.225,1.4; 11 -0.675,1.4; 12 -1.125,1.4 | smd 2.55 x 1.65: EXP 0,0
SOT666 = smd 0.3 x 0.99: 1 -0.5,-0.805; 2 0,-0.805; 3 0.5,-0.805; 4 0.5,0.805; 5 0,0.805; 6 -0.5,0.805
QFN50P700X700X60-49N = smd 0.85 x 0.3: 1 -3.45,2.75; 2 -3.45,2.25; 3 -3.45,1.75; 4 -3.45,1.25; 5 -3.45,0.75; 6 -3.45,0.25; 7 -3.45,-0.25; 8 -3.45,-0.75; 9 -3.45,-1.25; 10 -3.45,-1.75; 11 -3.45,-2.25; 12 -3.45,-2.75; 25 3.45,-2.75; 26 3.45,-2.25; 27 3.45,-1.75; 28 3.45,-1.25; 29 3.45,-0.75; 30 3.45,-0.25; 31 3.45,0.25; 32 3.45,0.75; 33 3.45,1.25; 34 3.45,1.75; 35 3.45,2.25; 36 3.45,2.75 | smd 0.3 x 0.85: 13 -2.75,-3.45; 14 -2.25,-3.45; 15 -1.75,-3.45; 16 -1.25,-3.45; 17 -0.75,-3.45; 18 -0.25,-3.45; 19 0.25,-3.45; 20 0.75,-3.45; 21 1.25,-3.45; 22 1.75,-3.45; 23 2.25,-3.45; 24 2.75,-3.45; 37 2.75,3.45; 38 2.25,3.45; 39 1.75,3.45; 40 1.25,3.45; 41 0.75,3.45; 42 0.25,3.45; 43 -0.25,3.45; 44 -0.75,3.45; 45 -1.25,3.45; 46 -1.75,3.45; 47 -2.25,3.45; 48 -2.75,3.45 | smd 5.7 x 5.7: 49 0,0
MAXM86161 = smd 0.85 x 0.4: 1 -1.2,2.4; 2 -1.2,1.6; 3 -1.2,0.8; 4 -1.2,0; 5 -1.2,-0.8; 6 -1.2,-1.6; 7 -1.2,-2.4; 8 1.2,-2.4; 9 1.2,-1.6; 10 1.2,-0.8; 11 1.2,0; 12 1.2,0.8; 13 1.2,1.6; 14 1.2,2.4
QFN-COL = smd 0.67 x 0.25: P$1 -1.17,0.99; P$2 -1.17,0.49; P$3 -1.17,-0.01; P$4 -1.17,-0.51; P$5 -1.17,-1.01; P$9 1.17,-1; P$10 1.17,-0.5; P$11 1.17,0; P$12 1.17,0.5; P$13 1.17,1 | smd 0.25 x 0.67: P$6 -0.5,-1.26; P$7 0,-1.26; P$8 0.5,-1.26; P$14 0.5,1.26; P$15 0,1.26; P$16 -0.5,1.26
SOIC127P600X165-8N = smd 1.46 x 0.61: 1 -2.775,1.905; 2 -2.775,0.635; 3 -2.775,-0.635; 4 -2.775,-1.905; 5 2.775,-1.905; 6 2.775,-0.635; 7 2.775,0.635; 8 2.775,1.905
CM315 = smd 1.1 x 1.9: P$1 -1.25,0; P$2 1.25,0

### Placement (x,y rotation side)
C1  9.73,12.22 0 top
C2  6.17,12.22 180 top
C3  3.89,15.27 90 top
C4  13.84,3.78 0 top
C5  13.84,9.88 180 top
C6  6.59,21.08 270 top
C7  3.56,25.42 180 top
C8  25.73,6.58 270 top
C9  19.38,9.12 180 top
C10  7.11,26.42 270 top
C11  11.18,23.88 180 top
C12  8.05,7.9 270 bottom
C13  3.23,7.9 270 bottom
C14  3.3,3.48 270 top
C15  5.59,8.31 90 top
C16  3.3,7.29 90 top
C17  37.34,25.65 90 top
C18  33.69,26.16 0 top
C19  7.5,25 90 bottom
C20  26.7,24.38 90 top
C21  28.73,24.38 90 top
C22  30.77,24.38 90 top
C23  36.96,13.72 0 top
C24  36.07,20.07 270 top
C25  25.65,14.19 90 top
C26  35.18,11.94 180 top
C27  22.61,27.43 0 top
C28  19.05,26.42 90 top
C29  16.26,13.21 180 top
C30  16.26,15.49 180 top
C31  23.11,14.61 270 top
C32  19.05,22.61 270 top
C33  32.26,3.99 90 top
C34  17.27,1.52 180 bottom
C35  12.19,1.52 0 bottom
C36  12.93,8.1 180 bottom
C37  28.19,1.52 180 bottom
C38  12.19,18.8 0 bottom
D1  29.72,3.99 90 top
DRILEGEND  [DRILEGEND]  6.35,-8.89 0 top  (outside the outline)
FB1  26.67,27.43 180 top
J1  5.33,2.16 0 bottom
J2  4.98,17.42 0 bottom
J3  35.31,15.01 0 bottom
J4  20,4.7 90 bottom
L1  22.94,7.34 270 top
L2  14.99,25.65 270 top
M1  35.81,3.99 180 top
Q1  34.54,8.56 270 top
R1  11.25,15.52 270 top
R3  23.19,3.78 0 top
R4  19.38,3.78 0 top
R5  7.87,8.31 90 top
R6  6.91,11.46 270 bottom
R7  4.37,11.46 270 bottom
R8  34.04,27.43 180 bottom
R9  17.02,27.43 0 bottom
R10  36.07,16.26 90 top
R11  30.26,27.43 0 top
R12  37.85,16.26 270 top
R13  13.77,20.51 270 top
R14  16.21,20.51 270 top
R15  23.47,1.52 0 bottom
R16  30.99,8.56 270 top
S1  28.96,28.19 180 bottom
S2  21.59,28.19 180 bottom
TP_CLK_OUT  25.22,21.41 0 top
TP_RTC_OUT  37.52,22.58 0 top
U1  7.57,15.17 0 top
U2  13.84,6.83 90 top
U3  3.43,21.13 180 top
U4  19.63,6.58 270 top
U5  10.67,26.67 0 top
U6  6.71,4.32 270 top
U7  5.64,7.9 0 bottom
U8  30.79,17.79 270 top
U9  20.13,14.97 0 top
U10  22.17,24.34 0 top
U11  11.27,13.87 90 bottom
Y1  34.07,23.88 180 top

### Tracks (layer width: path | path; a pad name or v marks a point on that pad's centre or on a via)
/RESET
  Top 0.152: U6.2 4.87,4.99 3.45,6.42 C16.1 3.4,6.52 6.93,6.52 R5.1
ACC_IR1
  Top 0.152: U8.12 27,21.24 23.9,24.34 U10.P$11
ACC_IR2
  Top 0.152: U8.14 25.04,20.04 23.34,21.74 U10.P$9
BUTTON1  (via drill 0.3)
  Top 0.152: U8.10 29.04,22.11 v28.78,22.38
  Bottom 0.152: R8.1 31.09,27.43 S1.2 S1.1 28.78,26.15 v28.78,22.38
BUTTON2  (via drill 0.3)
  Top 0.152: U8.11 28.54,21.79 27.95,22.38 v27.76,22.38
  Bottom 0.152: R9.1 19.99,27.43 20.06,27.5 S2.1 S2.2 25.34,27.47 27.76,25.05 v27.76,22.38
BYP
  Top 0.152: U10.P$2 20.4,24.83 C32.1
CLK_OUT
  Top 0.152: U8.13 26.09,20.54 TP_CLK_OUT.P$1
CONS_D_N
  Bottom 0.152: U7.1 6.14,6.52 5.97,6.35 5.97,4.83 J1.2
CONS_D_P
  Bottom 0.152: U7.3 5.14,6.52 5.33,6.33 J1.3
CONS_VB  (via drill 0.36)
  Top 0.152: U6.4 3.56,4.09 C14.1 3.11,4.36 1.91,5.56 1.91,8.87 3.35,10.31 6.72,10.31 R5.2 10.58,9.16 v10.87,9.45
  Top 0.203: C2.1 C1.1 | C1.1 8.85,14.18 U1.4 | v10.87,9.45 8.85,11.47 C1.1
  Top 0.254: 3.75,22.31 U3.2 | 3.75,22.31 4.34,21.72 6.35,21.72 C6.1 8.47,21.96 12.93,17.5 12.93,12.06 10.87,10.01 v10.87,9.45 | U3.6 3.1,21.66 3.75,22.31
  Bottom 0.152: U7.5 5.64,8.18 5.89,7.92 6.5,7.92 6.96,7.47 6.96,6.02
  Bottom 0.254: J1.1 6.63,5.69 6.96,6.02 10.54,6.02 10.87,6.35 v10.87,9.45
DISPLAY_D/C  (via drill 0.3)
  Top 0.152: U8.25 28.04,13.74 v27.38,13.08
  Bottom 0.152: J4.15 22.8,6.8 24.66,8.66 26.57,8.66 27.38,9.47 v27.38,13.08
DISPLAY_RST  (via drill 0.3)
  Top 0.152: U8.26 28.54,13.3 v28.32,13.08
  Bottom 0.152: J4.16 23.6,6.63 25.09,8.13 27.1,8.13 28.09,9.12 28.09,12.85 v28.32,13.08
DISPLAY_VLOGIC  (via drill 0.3)
  Top 0.203: U2.1 13.19,4.01 C4.1 12.97,3.08 v14.12,1.93
  Bottom 0.203: J4.2 12.4,2.19 C35.1 13.72,1.52 v14.12,1.93
DISPLAY_VLOGIC_ON
  Top 0.152: U8.27 29.04,12.74 27.89,11.58 18.75,11.58 15.24,8.08 15.24,6.48 14.65,5.88 U2.3
DISPLAY_VPANEL  (via drill 0.3)
  Top 0.203: C8.1 25.78,7.4 25.69,7.4 24.74,6.45 24.74,4.48 R3.2 24.38,3.79 v26.26,1.91 | U4.1 20.54,7.38 25.66,7.38 C8.1 | C8.1 v25.73,10.01
  Bottom 0.203: J4.3 13.2,6.96 C36.1 12.05,8.56 13.32,9.83 25.55,9.83 v25.73,10.01 | J4.21 27.6,1.8 C37.1 26.64,1.52 v26.26,1.91
DISPLAY_VPANEL_ON
  Top 0.152: U4.3 19.38,10.27 20.27,11.15 28.14,11.15 29.54,12.55 U8.28
EEPROM_WP  (via drill 0.3)
  Top 0.152: U8.18 26.35,18.04 v26.19,17.88
  Bottom 0.152: v26.19,17.88 23.55,20.52 13.34,20.52 12.18,19.36 12.18,16.93 U11.7
FB
  Top 0.203: U4.6 19.38,4.63 R4.2 R3.1
GND  (via drill 0.3, 0.36)
  Top 0.152: U10.P$10 22.52,23.84 | U10.P$7 22.17,23.5 22.52,23.84 | 22.52,23.84 22.52,24.53 22.84,24.84 U10.P$12 v24.46,24.84 | C32.2 19.05,21.78 18.86,21.97 v17.91,21.97 | U8.47 35.22,20.04 C24.2 v37.21,19.19 | U8.23 26.13,15.54 C25.2 v24.57,15.07 v24.56,15.06 | U9.10 22.67,14.17 C31.2 v23.11,12.62 | U9.11 U9.10 | U9.10 U9.9 | U8.35 33.04,13.87 34.3,12.61 C26.2 34.3,10.81 v34.3,10.79 | U6.EXP 6.03,3.64 U6.5 4.34,3.64 C14.2 v1.45,4.46 | C15.2 4.65,9.18 v4.43,9.4 3.3,8.27 C16.2 | C29.2 15.04,12.86 v15.04,12.14 14.76,12.14 12.97,10.35 C5.2 | C18.2 v35.79,26.16 36.97,26.16 C17.2 | v37.83,12.6 v37.83,12.61 C23.2 37.83,15.39 R12.2 | v24.46,24.84 26.28,24.84 C20.2 C21.2 | C28.2 18.59,27.75 v18.59,28.55 | C27.2 23.48,27 24.46,26.02 v24.46,24.84 | U10.P$5 v21,22.07 v21.01,22.07 | U8.8 30.04,22.61 29.74,22.91 29.74,24.56 29.05,25.26 C21.2 | C30.2 15.03,15.85 v15.03,16.59 | C22.2 C21.2
  Top 0.203: U1.2 4.97,15.17 4,16.14 C3.2 3.89,16.43 6.22,18.77 v7.7,18.77 | C8.2 25.65,5.63 26.02,5.63 26.98,6.58 v26.98,6.86 | U2.5 13.84,8.68 12.97,9.55 C5.2 | U2.2 13.84,5.07 14.72,4.19 C4.2 15.88,4.94 v15.88,7.39 | U4.4 18.88,8.74 C9.2 16.79,7.4 v16.79,7.39 | R1.2 11.25,14.05 v10.6,13.39 v10.6,13.38 C1.2 | C2.2 3.79,12.22 v3.02,11.46 | R4.1 18.53,2.65 v19.2,1.98 | U4.8 20.38,6.11 19.91,6.58 U4.9 18.52,6.58 v17.7,7.39
  Top 0.254: U3.3 U3.4 2.45,25.19 C7.2 2.43,25.67 v2.43,27.51 | U5.2 8.66,26.67 7.53,25.54 C10.2 v7.11,24.41 | C11.2 v9.22,23.88 | v7.7,18.77 6.59,19.88 C6.2 | U3.5 2.17,18.8 v1.68,18.8
  Top 0.305: Q1.2 33.34,7.71 R16.2 v29.73,7.71 v29.72,7.72
  Bottom 0.152: U7.2 5.64,7.64 5.38,7.9 4.75,7.9 4.03,7.18 J1.5 | U11.4 10.62,11.1 | 10.62,11.1 U11.3 U11.2 | C35.2 11.32,1.53 | 1.46,4.46 v1.45,4.46 1.45,5.26 3.21,7.02 C13.2 | C19.2 2.42,27.5 v2.43,27.51 | C38.2 v10.19,18.8 | v37.21,19.19 33.48,19.19 J3.2 | v35.79,26.16 34.89,27.07 R8.2 | R9.2 17.29,28.55 v18.59,28.55 | C12.2 8.4,6.68 v10.2,6.68 | v10.6,13.39 10.6,11.11 10.62,11.1
  Bottom 0.203: J4.1 11.6,1.81 C35.2 | J4.6 J4.5 14.8,6.32 v15.88,7.39 14.52,7.39 C36.2 | J4.6 J4.7 | J4.7 J4.8 | J4.8 J4.9 18,7.09 v17.7,7.39 17.2,6.89 J4.8 | J4.22 28.4,2.19 C37.2 v30.18,1.52 | J1.M6 1.45,3.13 v1.45,4.46 | 11.32,1.53 10.68,2.16 v10.11,2.16 J1.M5 | J1.M1 1.46,4.46 | R15.2 21.95,1.52 v21.49,1.98 | C34.2 18.76,1.52 v19.2,1.97 v19.2,1.98 | v21.49,1.98 21.2,2.27 J4.13 J4.14 22,2.49 v21.49,1.98 | J4.7 16.4,7 v16.79,7.39 15.6,6.2 J4.6 | J4.19 J4.20 26.8,6.68 v26.98,6.86 26.7,6.86 26,6.16 J4.19
  Bottom 0.254: v1.68,18.8 4.88,18.8 J2.2 5.13,18.77 v7.7,18.77
  Bottom 0.305: J1.M2 7.8,2.61 J1.M5 J1.M3 J1.M4 J1.M6 2.87,2.61 J1.M1 3.23,4.82 J1.5
  pour Route2: 0,0 0,30 40,30 40,0
I2C2_SCL  (via drill 0.3, 0.36)
  Top 0.152: U8.21 26.17,16.54 v25.4,17.27 | U9.2 18.45,16.57 18.16,16.87 18.16,18.9 v18.92,19.66 | U10.P$4 20.61,23.83 20.22,23.44 20.22,20.95 v18.92,19.66 | v18.92,19.66 R14.2
  Bottom 0.152: v25.4,17.27 23.02,19.66 v18.92,19.66 14.28,15.01 11.43,15.01 10.63,15.81 U11.6
I2C2_SDA  (via drill 0.3, 0.36)
  Top 0.152: U8.22 25.71,16.04 v25.4,16.36 | v25.4,16.36 | U10.P$6 21.67,21.34 v18.92,18.59 18.92,17.38 U9.1 | v11.81,20.02 13.41,20.02 R13.2
  Bottom 0.152: v25.4,16.36 23.16,18.59 v18.92,18.59 18.87,18.59 14.71,14.43 10.82,14.43 9.37,15.88 U11.5 9.37,19.47 9.91,20.02 v11.81,20.02
IREF
  Bottom 0.203: J4.18 25.2,2.05 24.68,1.52 R15.1
LDO_EN
  Top 0.152: U9.3 19.66,15.77 20.17,16.28 20.17,17.5 22.21,19.54 U8.15
MOTOR_CTRL
  Top 0.152: Q1.1 33.34,9.41 R16.1 30.04,10.35 U8.29
MTGND
  Top 0.305: Q1.3 35.64,5.47 M1.1 35.46,4.86 C33.2 31.99,5.13 D1.A
N$1
  Top 0.152: U8.4 32.04,23.1 Y1.P$2 C18.1
N$2
  Top 0.152: U8.3 32.54,21.9 33.12,22.48 33.92,22.48 Y1.P$1 36.44,23.88 C17.1
N$3  (via drill 0.3)
  Top 0.152: U8.1 33.65,21.35 v34.49,21.35
  Bottom 0.152: v34.49,21.35 32.69,23.14 30.86,23.14 29.03,21.31 16.26,21.31 C19.1
N$4
  Top 0.254: U5.5 14.43,27.61 L2.1
N$9
  Top 0.152: U8.44 34.97,18.54 36.07,17.45 R10.2 R12.1
N$41
  Bottom 0.152: U7.4 3.3,8.7 C13.1 3.23,9.46 R7.2
N$42
  Bottom 0.152: U7.6 7.98,8.7 C12.1 8.05,9.46 R6.2
NRST  (via drill 0.3)
  Top 0.152: U8.7 30.54,23.29 C22.1 | C22.1 31.8,24.54 31.8,26.74 R11.2 | C22.1 31.22,23.06 v31.22,22.38
  Bottom 0.152: v31.22,22.38 31.22,20.92 J3.3
PROG
  Top 0.203: U1.5 11,16.12 R1.1
PULSE_SENS_GPIO
  Top 0.152: U8.17 25.55,18.54 23.58,16.57 U9.13
PULSE_SENS_IR
  Top 0.152: U8.16 25.34,19.04 23.67,17.37 U9.14
RTC_OUT
  Top 0.152: U8.2 33.04,21.77 33.27,22 36.93,22 TP_RTC_OUT.P$1
SPI1_DISPLAY_CS  (via drill 0.3)
  Top 0.152: U8.32 31.54,12.09 v32.16,11.46
  Bottom 0.152: v32.16,11.46 31.5,11.46 27.61,7.57 25.43,7.57 24.4,6.54 J4.17
SPI1_MOSI  (via drill 0.3)
  Top 0.152: U8.33 32.04,12.5 v32.16,12.38 v32.16,12.37
  Bottom 0.152: v32.16,12.37 32.16,12.83 30.99,13.99 27.15,13.99 26.59,13.44 26.59,9.7 26.11,9.22 22.4,9.22 19.6,6.42 J4.11
SPI1_SCLK  (via drill 0.3)
  Top 0.152: U8.39 34.81,16.04 35.03,16.26 38.53,16.26 39.04,15.75 39.04,9.42 v37.54,7.92
  Bottom 0.152: J4.12 20.4,2.03 21.82,0.61 30.23,0.61 v37.54,7.92
SW
  Top 0.203: U4.7 19.88,5.03 20.04,4.88 21.87,4.88 L1.2
SWCLK  (via drill 0.3)
  Top 0.152: U8.37 34.24,14.83 v34.75,14.33
  Bottom 0.152: v34.75,14.33 33.31,15.77 J3.1
SWDIO  (via drill 0.3)
  Top 0.152: U8.34 32.54,13.33 v32.79,13.08
  Bottom 0.152: v32.79,13.08 32.79,13.53 J3.4
USART1_RX  (via drill 0.3)
  Top 0.152: v29.39,11.51 29.25,11.51 27.84,10.1 27.84,2.08 27,1.25 13.66,1.25 10.37,4.54 U6.10 | U8.31 31.04,13.57 31.21,13.4 31.21,12.72 v30.63,12.14
  Bottom 0.152: v30.63,12.14 30.02,12.14 v29.39,11.51
USART1_TX  (via drill 0.3)
  Top 0.152: v29.39,10.57 28.32,9.5 28.32,1.83 27.28,0.79 13.43,0.79 11.03,3.19 U6.7 | U8.30 30.54,13.14 v30.63,13.06
  Bottom 0.152: v30.63,13.06 29.84,13.06 28.73,11.94 28.73,10.97 29.13,10.57 v29.39,10.57
USBDM  (via drill 0.3)
  Top 0.152: U6.1 5.98,6.12 8.36,6.12 9.2,6.96 v9.2,7.59
  Bottom 0.152: R6.1 7.32,12.71 7.44,12.71 8.05,12.1 8.05,10.44 9.47,9.02 9.47,7.87 v9.2,7.59
USBDP  (via drill 0.3)
  Top 0.152: v10.06,7.59 10.06,7.39 U6.12
  Bottom 0.152: R7.1 5.1,13.03 7.57,13.03 8.36,12.24 8.36,10.57 9.78,9.14 9.78,7.87 v10.06,7.59
V_BAT  (via drill 0.36)
  Top 0.203: U1.3 4.06,14.22 C3.1 3.43,14.39 2.39,15.43 v2.39,16.05
  Top 0.254: v2.39,16.05 2.39,16.38 4.4,18.39 U3.8
  Bottom 0.254: J2.1 4.92,16.05 v2.39,16.05
V_LDO
  Top 0.152: U9.4 17.65,14.97 C30.1
V_REF
  Top 0.152: U9.12 22.82,15.77 C31.1
VCCIO  (via drill 0.3)
  Top 0.152: U6.3 4.7,4.54 3.83,5.41 2.79,5.41 2.39,5.82 2.39,7.01 2.67,7.29 5.45,7.29 C15.1 6.46,8.31 10.31,8.31 10.82,7.8 10.82,5.92 10.13,5.23 v10.11,5.23 | U6.9 9.85,4.09 v10.11,3.83
  Bottom 0.152: v10.11,5.23 v10.11,3.83
VCOMH
  Bottom 0.203: J4.4 14,3.13 15.61,1.52 C34.1
VDD  (via drill 0.3, 0.36)
  Top 0.152: U10.P$1 19.26,25.33 C28.1 v17.93,25.54 | U10.P$14 22.67,26.07 21.73,27.01 C27.1 v21.73,28.52 | FB1.1 R11.1 v29.41,28.57 | U8.48 35.67,20.54 C24.1 v37.2,20.94 v37.21,20.94 | U8.24 27.34,15.01 C25.1 v25.65,12.24 | U9.5 18.09,14.17 C29.1 v17.13,12.13 v17.13,12.12 | U8.36 34.18,13.71 36.08,13.71 C23.1 | C23.1 36.05,13.69 C26.1 36.05,10.81 v36.05,10.79 | C23.1 36.08,15.39 R10.1 | v12.05,21.36 R13.1 R14.1 | C9.1 20.25,10.2 v20.6,10.54 | 14.72,10.98 v14.72,11
  Top 0.203: U4.2 19.88,8.75 C9.1 22.56,9.12 L1.1 | U2.4 14.49,9.66 C5.1 14.72,10.98
  Top 0.254: L2.2 14.07,24.25 12.6,25.73 U5.4 11.96,23.96 C11.1 12.05,21.37 v12.05,21.36
  Top 0.305: C33.1 35.5,3.11 M1.2 | C33.1 29.83,3.11 D1.C | C33.1 32.26,2.26 v32.59,1.93
  Bottom 0.152: U11.8 13.18,18.69 C38.1 14.43,18.8 v14.99,18.24 | S1.3 27.8,28.57 v29.41,28.57 30.71,28.57 S1.4 | S2.3 20.48,28.52 v21.73,28.52 23.3,28.52 S2.4
  pour Route15: 0,0 0,30 40,30 40,0
VDD_RAW
  Top 0.254: U3.1 4.4,25.39 | C7.1 4.43,25.97 5.75,27.29 C10.1 7.43,27.61 U5.1 10.21,27.61 10.67,27.15 10.67,26.14 10.26,25.73 U5.3
  Top 0.305: 4.4,25.39 C7.1
VDDA  (via drill 0.3)
  Top 0.152: U8.9 29.54,22.52 28.73,23.33 C21.1 C20.1 26.35,23.86 v25.4,23.86 | v25.43,26.24 25.82,26.63 FB1.2
  Bottom 0.152: v25.43,26.24 25.4,26.21 v25.4,23.86

### Text on the board
Bottom: Hypnos_V0
tPlace: SCL | SDA
tDocu: GS_CR7_SBC_Extension
bDocu: MIKROE-2759 / LIPO-Akku / 24.5 x 23.5 | Hypnos_V0
DrillLegend: LAYER-STACK
DrillLegend_01-16: 01-16